# EAGLE design shield (EAGLE 9.0.1)
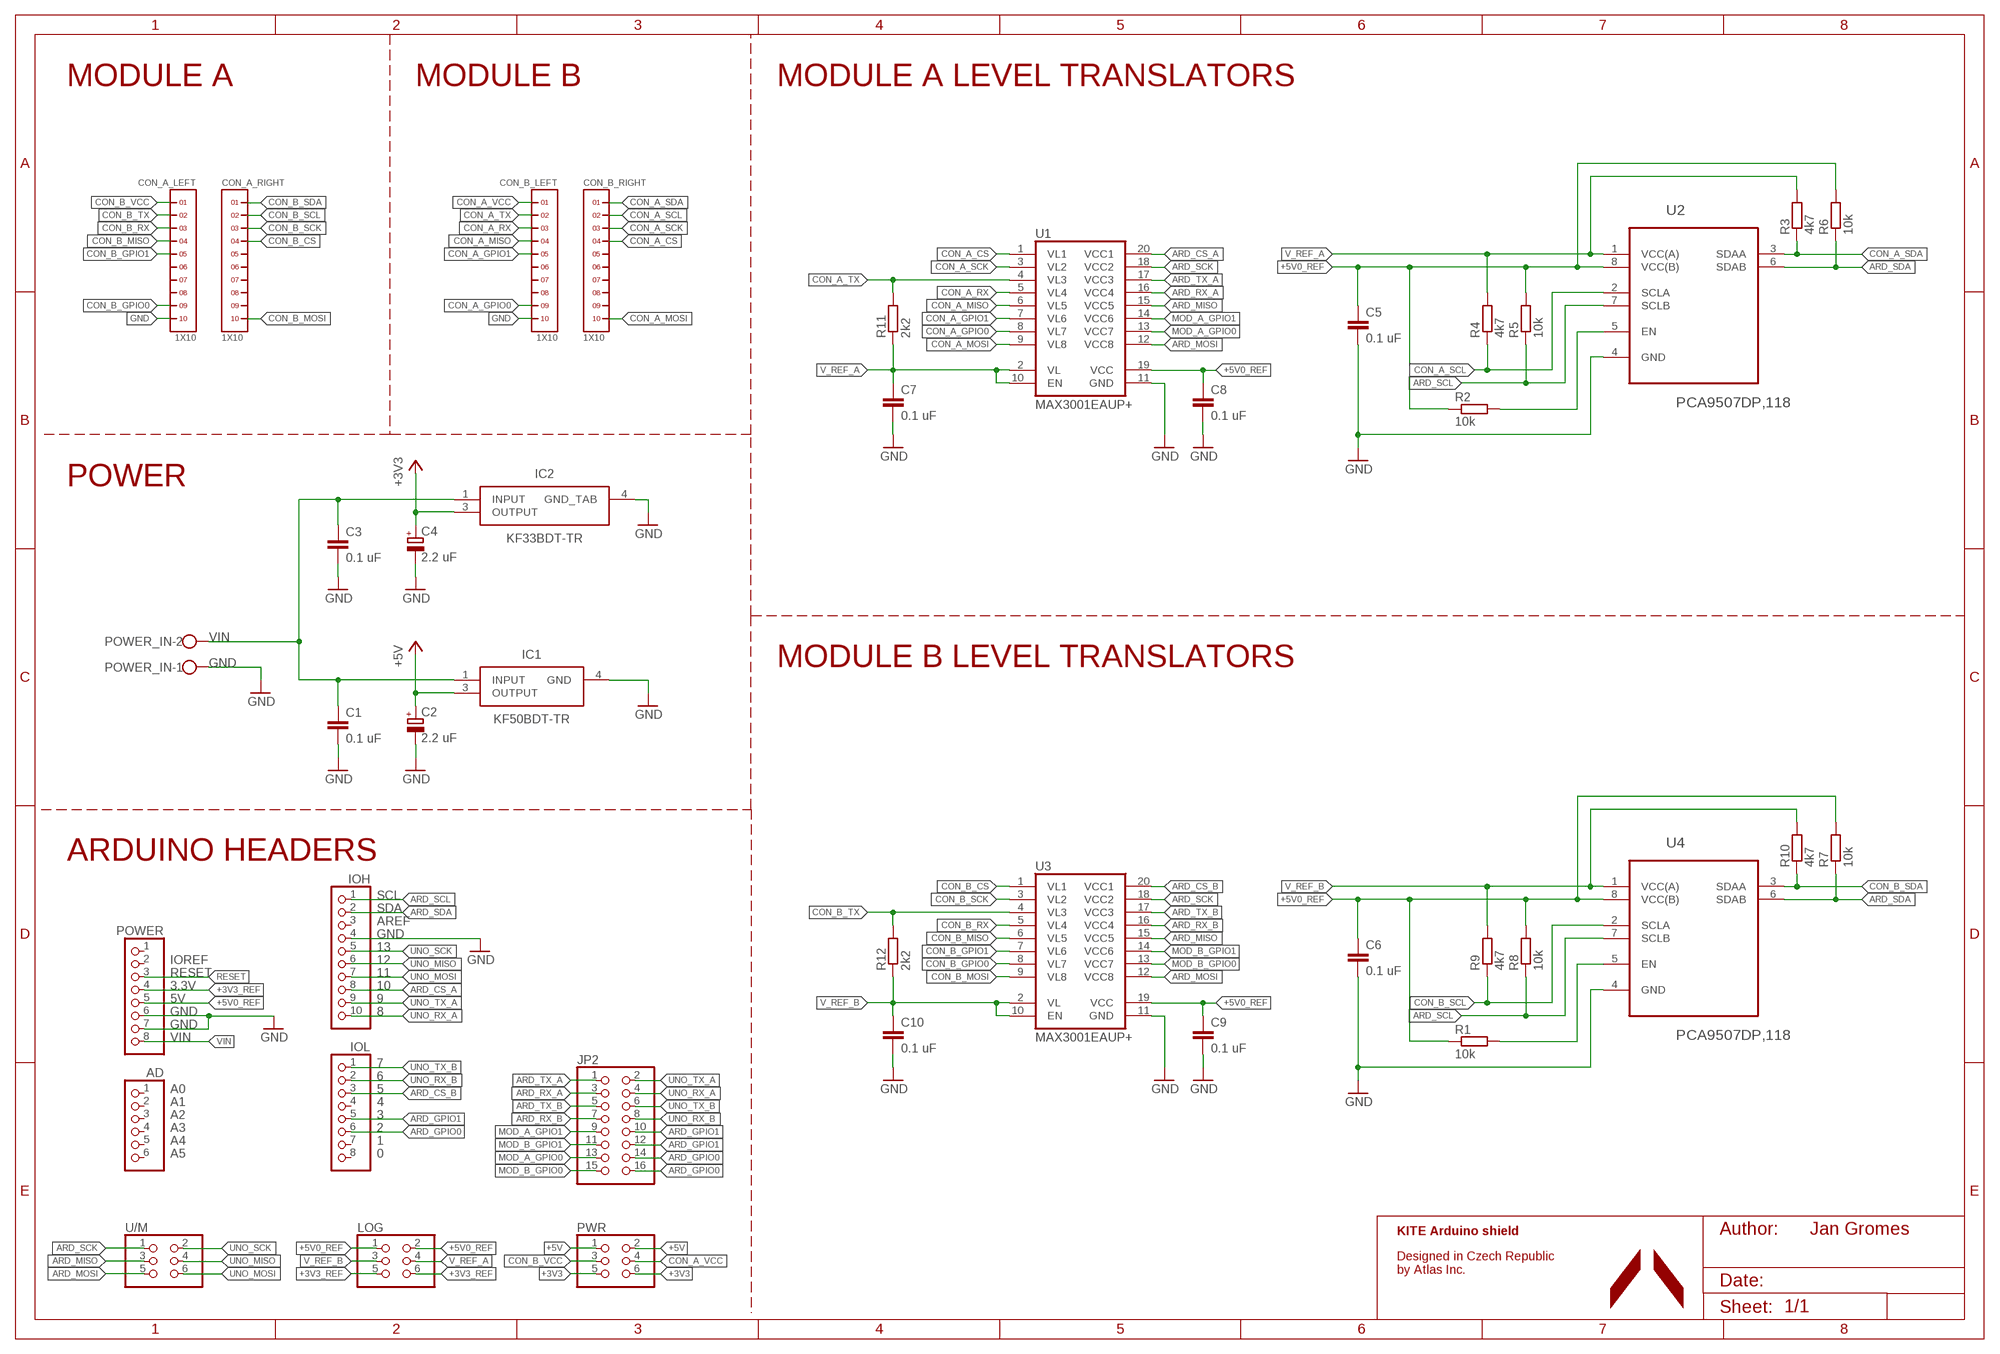
[diagram p0: schematic, sheet 1]

## Parts
AD  PINHD-1X6  [1X06]
C1  0.1 uF  C-EUC0603  [C0603]
C2  2.2 uF  CPOL-EUSMCA  [SMC_A]
C3  0.1 uF  C-EUC0603  [C0603]
C4  2.2 uF  CPOL-EUSMCA  [SMC_A]
C5  0.1 uF  C-EUC0603  [C0603]
C6  0.1 uF  C-EUC0603  [C0603]
C7  0.1 uF  C-EUC0603  [C0603]
C8  0.1 uF  C-EUC0603  [C0603]
C9  0.1 uF  C-EUC0603  [C0603]
C10  0.1 uF  C-EUC0603  [C0603]
CON_A_LEFT  1X10  [1X10]
CON_A_RIGHT  1X10  [1X10]
CON_B_LEFT  1X10  [1X10]
CON_B_RIGHT  1X10  [1X10]
IC1  KF50BDT-TR  [TO228P972X240-3N]
IC2  KF33BDT-TR  [TO228P972X240-3N]
IOH  PINHD-1X10  [1X10]
IOL  PINHD-1X8  [1X08]
JP2  PINHD-2X8  [2X08]
LOG  PINHD-2X3  [2X03]
POWER  PINHD-1X8  [1X08]
POWER_IN  W237-102  [W237-102]
PWR  PINHD-2X3  [2X03]
R1  10k  R-EU_R0603  [R0603]
R2  10k  R-EU_R0603  [R0603]
R3  4k7  R-EU_R0603  [R0603]
R4  4k7  R-EU_R0603  [R0603]
R5  10k  R-EU_R0603  [R0603]
R6  10k  R-EU_R0603  [R0603]
R7  10k  R-EU_R0603  [R0603]
R8  10k  R-EU_R0603  [R0603]
R9  4k7  R-EU_R0603  [R0603]
R10  4k7  R-EU_R0603  [R0603]
R11  2k2  R-EU_R0603  [R0603]
R12  2k2  R-EU_R0603  [R0603]
U1  MAX3001EAUP+  MAX3001  [TSSOP20]
U2  PCA9507DP,118  [SOP65P490X110-8N]
U3  MAX3001EAUP+  MAX3001  [TSSOP20]
U4  PCA9507DP,118  [SOP65P490X110-8N]
U/M  PINHD-2X3  [2X03]

## Nets
+3V3: C4.+ IC2.3(OUTPUT) PWR.5 PWR.6
+3V3_REF: LOG.5 LOG.6 POWER.4
+5V: C2.+ IC1.3(OUTPUT) PWR.1 PWR.2
+5V0_REF: C5.1 C6.1 C8.1 C9.1 LOG.1 LOG.2 POWER.5 R1.1 R2.1 R5.2 R6.2 R7.2 R8.2 U1.19(VCC) U2.8(VCC(B)) U3.19(VCC) U4.8(VCC(B))
ARD_CS_A: IOH.8 U1.20(VCC1)
ARD_CS_B: IOL.3 U3.20(VCC1)
ARD_GPIO0: IOL.6 JP2.14 JP2.16
ARD_GPIO1: IOL.5 JP2.10 JP2.12
ARD_MISO: U1.15(VCC5) U3.15(VCC5) U/M.3
ARD_MOSI: U1.12(VCC8) U3.12(VCC8) U/M.5
ARD_RX_A: JP2.3 U1.16(VCC4)
ARD_RX_B: JP2.7 U3.16(VCC4)
ARD_SCK: U1.18(VCC2) U3.18(VCC2) U/M.1
ARD_SCL: IOH.1 R5.1 R8.1 U2.7(SCLB) U4.7(SCLB)
ARD_SDA: IOH.2 R6.1 R7.1 U2.6(SDAB) U4.6(SDAB)
ARD_TX_A: JP2.1 U1.17(VCC3)
ARD_TX_B: JP2.5 U3.17(VCC3)
CON_A_CS: CON_B_RIGHT.4 U1.1(VL1)
CON_A_GPIO0: CON_B_LEFT.9 U1.8(VL7)
CON_A_GPIO1: CON_B_LEFT.5 U1.7(VL6)
CON_A_MISO: CON_B_LEFT.4 U1.6(VL5)
CON_A_MOSI: CON_B_RIGHT.10 U1.9(VL8)
CON_A_RX: CON_B_LEFT.3 U1.5(VL4)
CON_A_SCK: CON_B_RIGHT.3 U1.3(VL2)
CON_A_SCL: CON_B_RIGHT.2 R4.1 U2.2(SCLA)
CON_A_SDA: CON_B_RIGHT.1 R3.1 U2.3(SDAA)
CON_A_TX: CON_B_LEFT.2 R11.2 U1.4(VL3)
CON_A_VCC: CON_B_LEFT.1 PWR.4
CON_B_CS: CON_A_RIGHT.4 U3.1(VL1)
CON_B_GPIO0: CON_A_LEFT.9 U3.8(VL7)
CON_B_GPIO1: CON_A_LEFT.5 U3.7(VL6)
CON_B_MISO: CON_A_LEFT.4 U3.6(VL5)
CON_B_MOSI: CON_A_RIGHT.10 U3.9(VL8)
CON_B_RX: CON_A_LEFT.3 U3.5(VL4)
CON_B_SCK: CON_A_RIGHT.3 U3.3(VL2)
CON_B_SCL: CON_A_RIGHT.2 R9.1 U4.2(SCLA)
CON_B_SDA: CON_A_RIGHT.1 R10.1 U4.3(SDAA)
CON_B_TX: CON_A_LEFT.2 R12.2 U3.4(VL3)
CON_B_VCC: CON_A_LEFT.1 PWR.3
GND: C1.2 C2.- C3.2 C4.- C5.2 C6.2 C7.2 C8.2 C9.2 C10.2 CON_A_LEFT.10 CON_B_LEFT.10 IC1.4(GND) IC2.4(GND_TAB) IOH.4 POWER.6 POWER.7 POWER_IN.1 U1.11(GND) U2.4(GND) U3.11(GND) U4.4(GND)
MOD_A_GPIO0: JP2.13 U1.13(VCC7)
MOD_A_GPIO1: JP2.9 U1.14(VCC6)
MOD_B_GPIO0: JP2.15 U3.13(VCC7)
MOD_B_GPIO1: JP2.11 U3.14(VCC6)
N$1: R2.2 U2.5(EN)
N$2: R1.2 U4.5(EN)
RESET: POWER.3
UNO_MISO: IOH.6 U/M.4
UNO_MOSI: IOH.7 U/M.6
UNO_RX_A: IOH.10 JP2.4
UNO_RX_B: IOL.2 JP2.8
UNO_SCK: IOH.5 U/M.2
UNO_TX_A: IOH.9 JP2.2
UNO_TX_B: IOL.1 JP2.6
V_REF_A: C7.1 LOG.4 R3.2 R4.2 R11.1 U1.2(VL) U1.10(EN) U2.1(VCC(A))
V_REF_B: C10.1 LOG.3 R9.2 R10.2 R12.1 U3.2(VL) U3.10(EN) U4.1(VCC(A))
VIN: C1.1 C3.1 IC1.1(INPUT) IC2.1(INPUT) POWER.8 POWER_IN.2
Unconnected: AD.1 AD.2 AD.3 AD.4 AD.5 AD.6 CON_A_LEFT.6 CON_A_LEFT.7 CON_A_LEFT.8 CON_A_RIGHT.5 CON_A_RIGHT.6 CON_A_RIGHT.7 CON_A_RIGHT.8 CON_A_RIGHT.9 CON_B_LEFT.6 CON_B_LEFT.7 CON_B_LEFT.8 CON_B_RIGHT.5 CON_B_RIGHT.6 CON_B_RIGHT.7 CON_B_RIGHT.8 CON_B_RIGHT.9 IOH.3 IOL.4 IOL.7 IOL.8 POWER.1 POWER.2

## Notes on the sheet
- MODULE A | MODULE B | MODULE A LEVEL TRANSLATORS
- POWER
- MODULE B LEVEL TRANSLATORS
- ARDUINO HEADERS
- SCL
- SDA
- AREF
- 13
- IOREF | 12
- RESET | 11
- 3.3V | 10
- 5V | 9
- GND | 8
- VIN
- 7
- 6
- A0 | 5
- A1 | 4
- A2 | 3
- A3 | 2
- A4 | 1
- A5 | 0
- KITE Arduino shield | Jan Gromes
- Designed in Czech Republic
  by Atlas Inc.

## Library data of the parts
AD = pinhead:PINHD-1X6: PIN HEADER
C1 C3 C5-C10 = rcl:C-EU: CAPACITOR, European symbol
C2 C4 = rcl:CPOL-EU: POLARIZED CAPACITOR, European symbol; SPICEPREFIX: C
CON_A_LEFT CON_A_RIGHT CON_B_LEFT CON_B_RIGHT = headers(2mm):1X10
IC1 = KF50BDT-TR:KF50BDT-TR: KF50BDT-TR, Low Dropout Voltage Regulator, 0.5A, 5 V 2%, -0.5 20 Vin, 3-Pin DPAK <https://componentsearchengine.com/Images/3/KF50BDT-TR.jpg> Source: Datasheet <http://www.st.com/web/en/resource/technical/document/datasheet/CD00000970.pdf>; ALLIED_NUMBER: 70389972; DESCRIPTION: KF50BDT-TR, Low Dropout Voltage Regulator, 0.5A, 5 V 2%, -0.5 20 Vin, 3-Pin DPAK; HEIGHT: 2.4mm; MANUFACTURER_NAME: STMicroelectronics; MANUFACTURER_PART_NUMBER: KF50BDT-TR; RS_PART_NUMBER: 7140619; SUPPLIER_NAME: RS
IC2 = KF33BDT-TR:KF33BDT-TR: LDO Regulator, 3.3V, 0.5A, DPAK KF33BDT-TR, Low Dropout Voltage Regulator, 0.5A, 3.3 V 2%, 2.5 20 Vin, 3-Pin DPAK <https://componentsearchengine.com/Images/9/KF33BDT-TR.jpg> Source: Datasheet <http://www.st.com/web/en/resource/technical/document/datasheet/CD00000970.pdf>; ALLIED_NUMBER: 70389971; DESCRIPTION: LDO Regulator, 3.3V, 0.5A, DPAK KF33BDT-TR, Low Dropout Voltage Regulator, 0.5A, 3.3 V 2%, 2.5 20 Vin, 3-Pin DPAK; HEIGHT: 2.4mm; MANUFACTURER_NAME: STMicroelectronics; MANUFACTURER_PART_NUMBER: KF33BDT-TR; RS_PART_NUMBER: 7140616; SUPPLIER_NAME: RS
IOH = pinhead:PINHD-1X10: PIN HEADER
IOL POWER = pinhead:PINHD-1X8: PIN HEADER
JP2 = pinhead:PINHD-2X8: PIN HEADER
LOG PWR U/M = pinhead:PINHD-2X3: PIN HEADER
POWER_IN = con-wago-500:W237-102: WAGO SCREW CLAMP; MPN: 237-102; OC_FARNELL: unknown; OC_NEWARK: 70K9898
R1-R12 = rcl:R-EU_: RESISTOR, European symbol
U1 U3 = maxim-11:MAX30*: +1.2V to +5.5V, ±15kV ESD-Protected, 0.1?A, 35Mbps, 8-Channel Level Translators
U2 U4 = NXP_By_element14_Batch_1:PCA9507DP,118: 2-wire serial bus extender for HDMI DDC I2C-bus and SMBus; MPN: PCA9507DP,118; OC_FARNELL: -; OC_NEWARK: 70R6456; PACKAGE: TSSOP-8; SUPPLIER: NXP Semiconductors

## Board
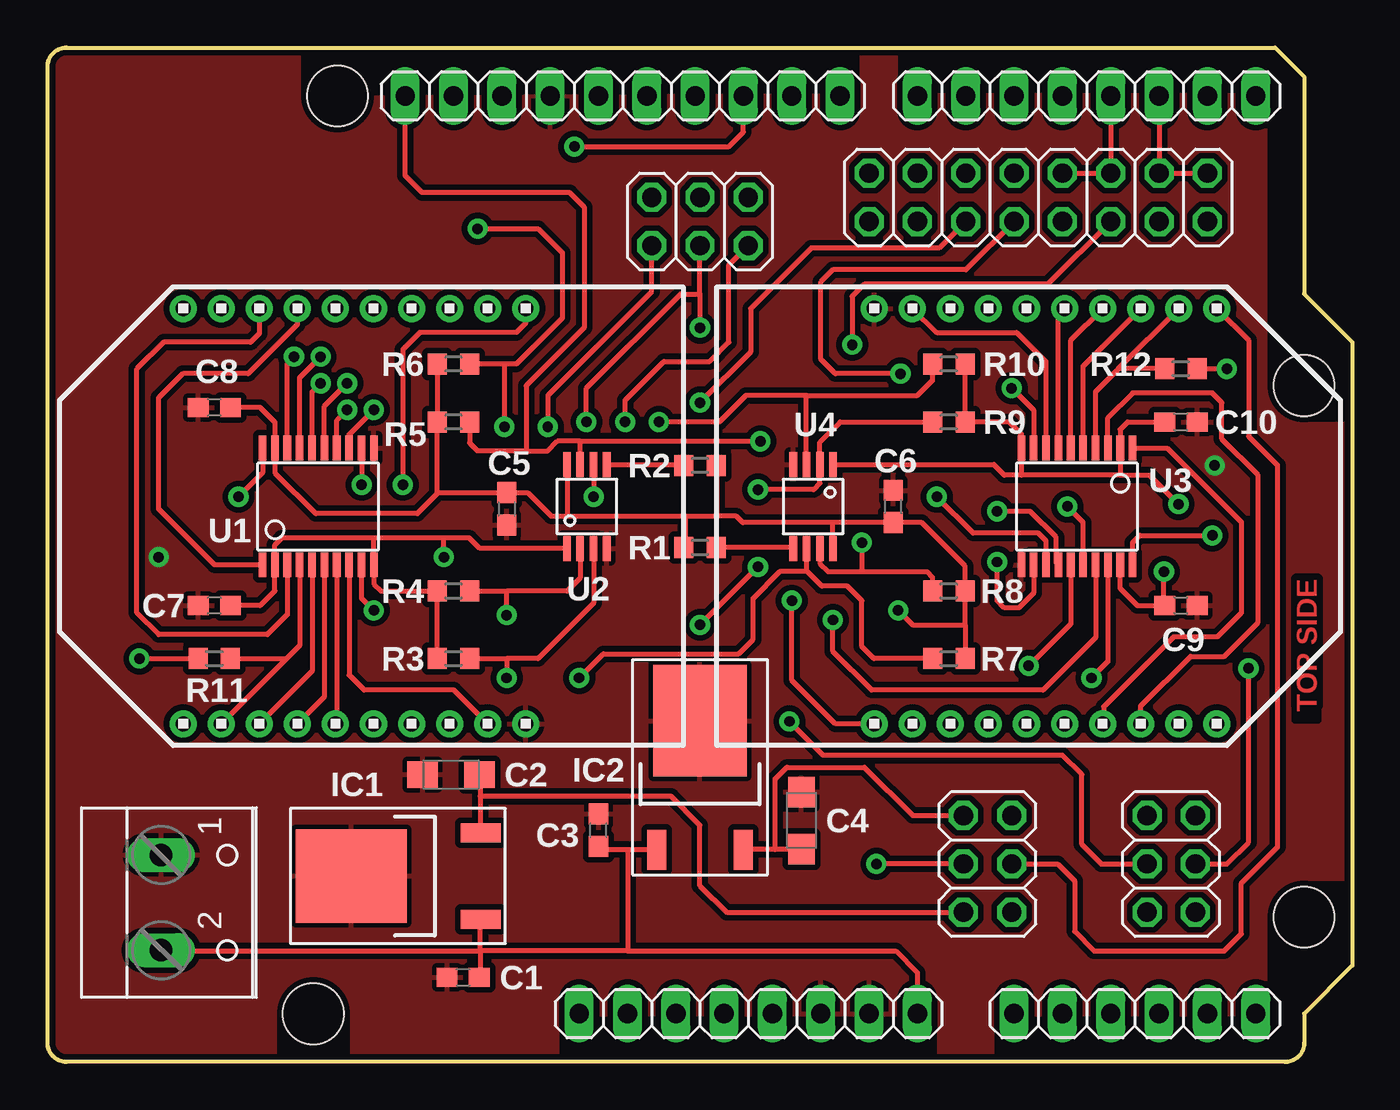
[diagram p1: board, top side]
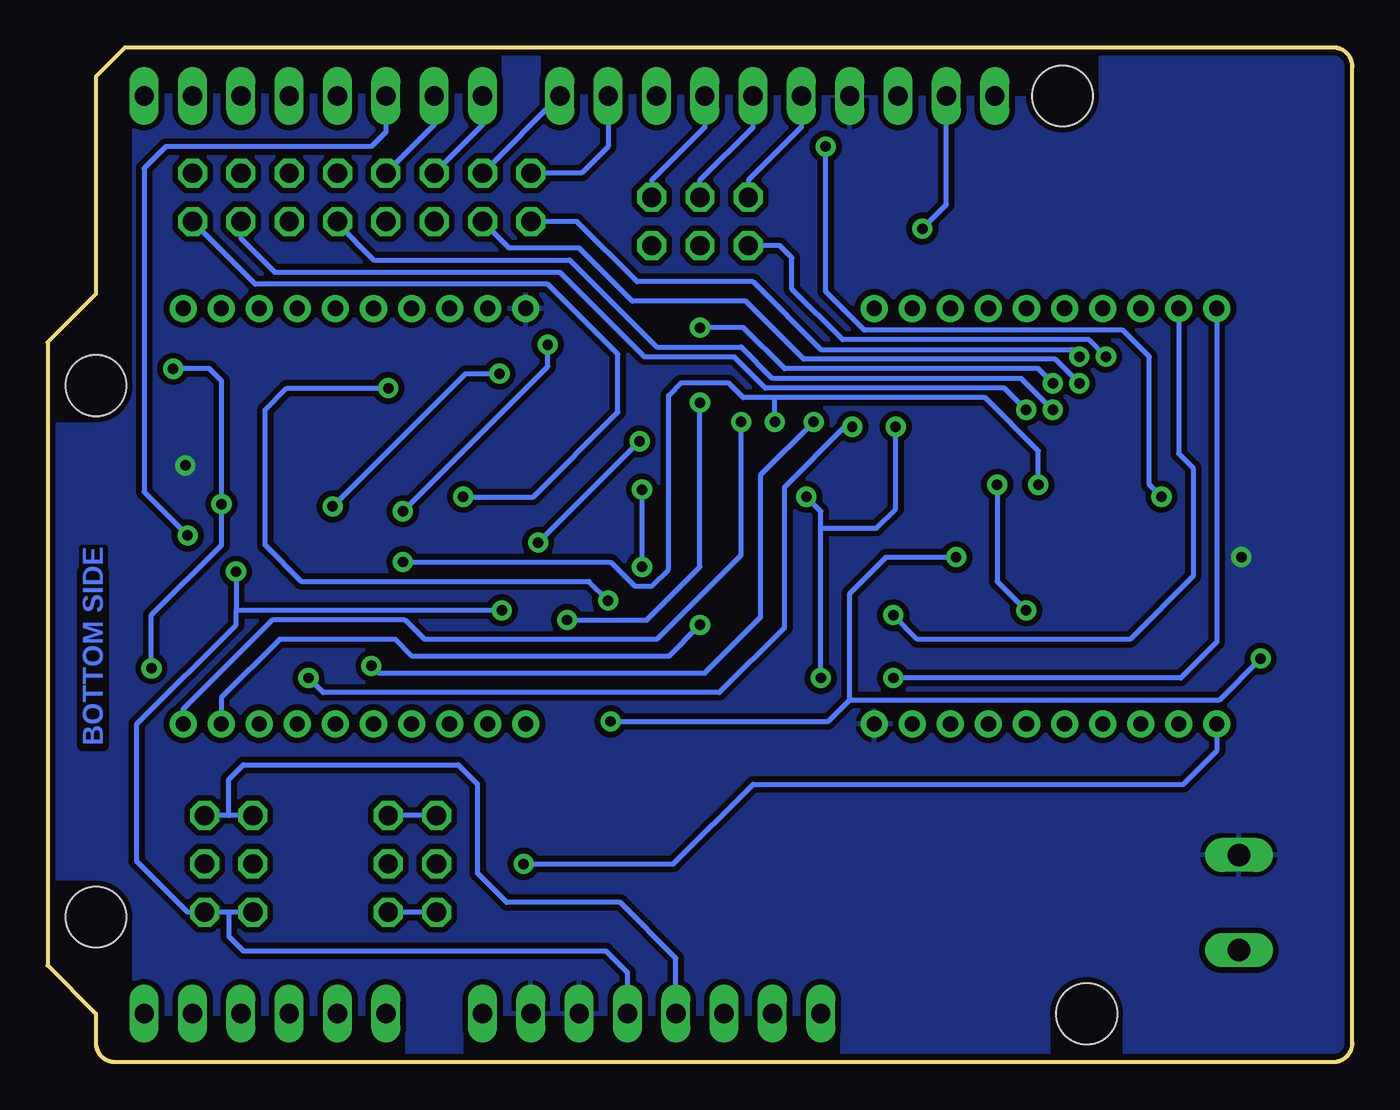
[diagram p2: board, bottom side, seen from below]

Size 68.58 x 53.34 mm. Coordinates in mm from the lower left corner, seen from the top.
Outline: 64.52,53.34 66.04,51.82 66.04,40.39 68.58,37.85 68.58,5.08 66.04,2.54 66.04,1 arc-90 65.04,0 1,0 arc-90 0,1 0,52.34 arc-90 1,53.34 64.52,53.34
Copper layers (1*16): Top 0.035mm / dielectric 1.5mm / Bottom 0.035mm
Design rules "SparkFun-2-layer-STANDARD": minimum track width 10mil, minimum drill 20mil, track to track 10mil, track to pad 8mil, pad to pad 8mil, via to via 10mil, smd to smd 8mil, copper to edge 8mil, drill to drill 8mil, minimum pad ring 10mil, minimum via ring 10mil, stop-mask expansion 4mil, vias tented up to drill 25mil, thermal gap 10mil
Holes 3.2 mm at 13.97,2.54 66.04,7.62 66.04,35.56 15.24,50.8

### Footprints (pad centres in the part's own frame; a part is rotated, then mirrored left to right if it is on the bottom)
1X06 = drill 1.016 long: 1 -6.35,0; 2 -3.81,0; 3 -1.27,0; 4 1.27,0; 5 3.81,0; 6 6.35,0
C0603 = smd 1.1 x 1: 1 -0.85,0; 2 0.85,0
SMC_A = smd 1.6 x 1.4: + -1.5,0; - 1.5,0
1X10 = drill 0.8 pad 1.422: 1 -9,0; 2 -7,0; 3 -5,0; 4 -3,0; 5 -1,0; 6 1,0; 7 3,0; 8 5,0; 9 7,0; 10 9,0
TO228P972X240-3N = smd 2.1 x 1: 1 -4.35,2.28; 3 -4.35,-2.28 | smd 5.85 x 4.9: 4 2.45,0
1X10' = drill 1.016 long: 1 -11.43,0; 2 -8.89,0; 3 -6.35,0; 4 -3.81,0; 5 -1.27,0; 6 1.27,0; 7 3.81,0; 8 6.35,0; 9 8.89,0; 10 11.43,0
1X08 = drill 1.016 long: 1 -8.89,0; 2 -6.35,0; 3 -3.81,0; 4 -1.27,0; 5 1.27,0; 6 3.81,0; 7 6.35,0; 8 8.89,0
2X08 = drill 1.016 octagon: 1 -8.89,-1.27; 2 -8.89,1.27; 3 -6.35,-1.27; 4 -6.35,1.27; 5 -3.81,-1.27; 6 -3.81,1.27; 7 -1.27,-1.27; 8 -1.27,1.27; 9 1.27,-1.27; 10 1.27,1.27; 11 3.81,-1.27; 12 3.81,1.27; 13 6.35,-1.27; 14 6.35,1.27; 15 8.89,-1.27; 16 8.89,1.27
2X03 = drill 1.016 octagon: 1 -2.54,-1.27; 2 -2.54,1.27; 3 0,-1.27; 4 0,1.27; 5 2.54,-1.27; 6 2.54,1.27
W237-102 = drill 1.194 long: 1 -2.5,-1.27; 2 2.5,-1.27
R0603 = smd 1 x 1.1: 1 -0.85,0; 2 0.85,0
TSSOP20 = smd 0.4 x 1.3: 1 -2.925,-3.068; 2 -2.275,-3.068; 3 -1.625,-3.068; 4 -0.975,-3.068; 5 -0.325,-3.068; 6 0.325,-3.068; 7 0.975,-3.068; 8 1.625,-3.068; 9 2.275,-3.068; 10 2.925,-3.068; 11 2.925,3.068; 12 2.275,3.068; 13 1.625,3.068; 14 0.975,3.068; 15 0.325,3.068; 16 -0.325,3.068; 17 -0.975,3.068; 18 -1.625,3.068; 19 -2.275,3.068; 20 -2.925,3.068
SOP65P490X110-8N = smd 1.3 x 0.4: 1 -2.207,1.015; 2 -2.207,0.33; 3 -2.207,-0.38; 4 -2.207,-1.065; 5 2.207,-1.065; 6 2.207,-0.38; 7 2.207,0.33; 8 2.207,1.015

### Placement (x,y rotation side)
AD  57.15,2.54 0 top
C1  21.84,4.45 180 top
C2  21.21,15.11 180 top
C3  28.96,12.19 90 top
C4  39.62,12.7 90 top
C5  24.13,29.08 270 top
C6  44.45,29.21 90 top
C7  8.76,24 180 top
C8  8.76,34.42 180 top
C9  59.56,24 0 top
C10  59.56,33.66 0 top
CON_A_LEFT  52.45,39.62 180 top
CON_A_RIGHT  52.45,17.78 180 top
CON_B_LEFT  16.13,17.78 0 top
CON_B_RIGHT  16.13,39.62 0 top
IC1  18.41,9.78 180 top
IC2  34.29,15.49 90 top
IOH  [1X10']  30.23,50.8 0 top
IOL  54.61,50.8 0 top
JP2  52.07,45.47 0 top
LOG  59.05,10.41 90 top
POWER  36.83,2.54 0 top
POWER_IN  7.24,8.38 270 top
PWR  49.4,10.41 90 top
R1  34.29,27.05 0 top
R2  34.29,31.37 180 top
R3  21.34,21.21 180 top
R4  21.34,24.77 180 top
R5  21.34,33.66 180 top
R6  21.34,36.7 180 top
R7  47.37,21.21 0 top
R8  47.37,24.77 0 top
R9  47.37,33.66 0 top
R10  47.37,36.7 0 top
R11  8.76,21.21 0 top
R12  59.56,36.45 180 top
U1  14.22,29.21 0 top
U2  28.32,29.21 90 top
U3  54.1,29.21 180 top
U4  40.26,29.21 270 top
U/M  34.29,44.2 0 top

### Tracks (layer width: path | path; a pad name or v marks a point on that pad's centre or on a via)
+3V3
  Top 0.254: 38.23,11.18 38.23,14.86 38.86,15.49 42.93,15.49 45.47,12.95 PWR.6 | 38.23,11.18 36.57,11.18 IC2.3 | C4.+ 39.6,11.18 38.23,11.18
  Bottom 0.254: PWR.6 PWR.5
+3V3_REF
  Bottom 0.254: POWER.4 35.56,5.46 38.48,8.38 44.45,8.38 45.97,9.91 45.97,14.61 46.99,15.62 58.29,15.62 59.05,14.86 59.05,12.95 | LOG.6 59.05,12.95 | 59.05,12.95 LOG.5
+5V
  Top 0.254: PWR.2 35.69,7.87 34.29,9.27 34.29,12.45 32.77,13.97 22.73,13.97 | 22.73,13.97 22.73,12.06 IC1.3 | C2.+ 22.73,15.09 22.73,13.97
  Bottom 0.254: PWR.2 PWR.1
+5V0_REF  (via drill 0.55)
  Top 0.254: C8.1 11.18,34.42 11.95,33.64 U1.19 11.95,30.98 14.1,28.83 19.43,28.83 20.49,29.88 20.49,29.93 | U3.19 56.38,24.9 57.28,24 C9.1 58.67,24.04 v58.67,25.78 | R6.2 R5.2 20.49,29.93 | 48.22,22.99 R7.2 | 48.22,22.99 R8.2 48.22,26.07 45.94,28.36 C6.1 41.27,28.36 | v44.7,23.75 45.47,22.99 48.22,22.99 | 33.53,28.7 35.18,28.7 | 27.31,28.7 26.46,28.7 25.23,29.93 C5.1 20.49,29.93 | 27.31,28.7 33.53,28.7 | R2.1 35.18,31.37 35.18,28.7 | R1.1 33.53,27.05 33.53,28.7 | U4.8 | U2.8 27.31,28.7 | 35.18,28.7 36.2,28.7 36.54,28.36 41.27,28.36 | U4.8 41.27,28.36
  Bottom 0.254: POWER.5 38.1,4.7 39.24,5.84 58.29,5.84 59.05,6.6 59.05,7.87 | v44.7,23.75 58.67,23.75 | v58.67,25.78 58.67,23.75 | 58.67,23.75 58.67,22.99 63.88,17.78 63.88,10.54 61.21,7.87 LOG.1 59.05,7.87 | LOG.2 59.05,7.87
ARD_CS_A  (via drill 0.55)
  Top 0.254: U1.20 11.3,30.98 v10.03,29.72 | v27.69,48.13 35.81,48.13 36.58,48.9 IOH.8
  Bottom 0.254: v10.03,29.72 10.67,30.35 10.67,37.08 12.06,38.48 25.65,38.48 27.69,40.51 v27.69,48.13
ARD_CS_B  (via drill 0.55)
  Top 0.254: U3.20 57.03,27.31 57.4,27.69 v61.21,27.69
  Bottom 0.254: v61.21,27.69 63.5,29.97 63.5,46.99 62.36,48.13 51.56,48.13 50.8,48.9 IOL.3
ARD_GPIO0
  Top 0.254: IOL.6 JP2.14 JP2.16
ARD_GPIO1
  Top 0.254: IOL.5 JP2.12 JP2.10
ARD_MISO  (via drill 0.55)
  Top 0.254: U1.15 14.55,34.49 v15.75,35.69 | U3.15 53.78,23.04 v51.56,20.83 | 34.29,40.39 U/M.3 | 34.29,40.39 v34.29,38.61 | 34.29,40.39 33.27,40.39 28.32,35.43 v28.32,33.66
  Bottom 0.254: v15.75,35.69 16.51,36.45 29.84,36.45 32,38.61 v34.29,38.61 | v28.32,33.66 31.11,30.86 31.11,23.37 34.04,20.45 51.18,20.45 v51.56,20.83
ARD_MOSI  (via drill 0.55)
  Top 0.254: v30.35,33.66 30.35,34.8 32.38,36.83 34.8,36.83 35.81,37.85 35.81,41.91 U/M.5 | U1.12 16.51,32.27 v16.51,30.35 | U3.12 51.83,24.65 51.05,23.88 50.29,23.88 49.91,24.26 v49.91,26.29
  Bottom 0.254: v16.51,30.35 16.51,32.13 19.3,34.92 30.35,34.92 | v30.35,33.66 30.35,34.92 | 30.35,34.92 32,34.92 32.77,35.69 35.31,35.69 35.94,35.05 35.94,25.91 36.83,25.02 37.72,25.02 38.99,26.29 v49.91,26.29
ARD_RX_A  (via drill 0.55)
  Top 0.254: U1.16 13.9,35.23 v14.35,35.69
  Bottom 0.254: v14.35,35.69 15.62,36.96 28.83,36.96 31.88,40.01 37.85,40.01 40.64,42.8 44.32,42.8 JP2.3
ARD_RX_B  (via drill 0.55)
  Top 0.254: JP2.7 48.26,41.66 41.27,41.66 40.64,41.02 40.64,36.96 41.4,36.2 v44.83,36.2 | U3.16 54.43,28.38 v53.59,29.21
  Bottom 0.254: v53.59,29.21 46.61,36.2 v44.83,36.2
ARD_SCK  (via drill 0.55)
  Top 0.254: U1.18 12.6,36.73 v12.95,37.08 | U/M.1 31.75,40.51 26.29,35.05 v26.29,33.4 | U3.18 55.73,21.06 v54.86,20.19
  Bottom 0.254: v12.95,37.08 13.84,37.97 26.8,37.97 29.46,40.64 29.46,42.29 30.1,42.93 U/M.1 | v54.86,20.19 54.1,19.43 33.27,19.43 29.84,22.86 29.84,30.23 26.67,33.4 v26.29,33.4
ARD_SCL  (via drill 0.55)
  Top 0.254: 27.99,32.64 26.8,32.64 26.29,32.13 25.15,32.13 | 27.99,32.64 v37.47,32.64 | R5.1 22.19,32.55 22.61,32.13 25.15,32.13 | 25.15,32.13 25.15,35.56 28.19,38.61 28.19,44.96 27.43,45.72 19.68,45.72 18.8,46.61 IOH.1 | R8.1 46.52,25.49 46.23,25.78 42.8,25.78 | v42.8,27.3 42.8,25.78 | U2.7 27.99,32.64 | U4.7 40.59,26.21 41.02,25.78 42.8,25.78
  Bottom 0.254: v42.8,27.3 v37.47,32.64
ARD_SDA  (via drill 0.55)
  Top 0.254: 24,36.7 R6.1 | 24,36.7 v24,33.4 | v22.61,43.81 25.78,43.81 27.05,42.55 27.05,39.12 24.64,36.7 24,36.7 | 39.93,25.78 38.48,25.78 37.08,24.38 37.08,22.23 36.32,21.46 29.21,21.46 v27.94,20.19 | R7.1 43.43,21.21 42.8,21.84 42.8,24.26 42.04,25.02 40.69,25.02 39.93,25.78 | U2.6 v28.7,29.72 | U4.6 39.88,25.83 39.93,25.78
  Bottom 0.254: v24,33.4 24,29.08 25.02,28.07 27.94,28.07 | v27.94,20.19 27.94,28.07 | 27.94,28.07 27.94,28.96 v28.7,29.72 | v22.61,43.81 21.34,45.09 IOH.2
ARD_TX_A  (via drill 0.55)
  Top 0.254: U1.17 13.25,35.98 v14.35,37.08
  Bottom 0.254: v14.35,37.08 14.73,37.47 27.94,37.47 31.5,41.02 37.59,41.02 40.77,44.2 JP2.1
ARD_TX_B  (via drill 0.55)
  Top 0.254: U3.17 55.08,22.31 52.32,19.56 43.31,19.56 41.27,21.59 v41.27,23.24 | v34.29,34.67 36.96,37.34 36.96,39.62 40.13,42.8 46.86,42.8 JP2.5
  Bottom 0.254: v34.29,34.67 34.29,26.04 37.08,23.24 v41.27,23.24
CON_A_CS
  Top 0.254: CON_B_RIGHT.4 13.13,38.78 10.54,36.2 7.11,36.2 5.84,34.92 5.84,29.08 8.78,26.14 U1.1
CON_A_GPIO0
  Top 0.254: U1.8 15.85,20.35 16.64,19.56 21.35,19.56 CON_B_LEFT.9
CON_A_GPIO1
  Top 0.254: CON_B_LEFT.5 15.11,17.8 15.11,17.78 15.2,17.87 U1.7
CON_A_MISO
  Top 0.254: CON_B_LEFT.4 14.55,19.2 U1.6
CON_A_MOSI  (via drill 0.55)
  Top 0.254: U1.9 16.5,24.39 v17.14,23.75 | CON_B_RIGHT.10 25.13,38.84 24.64,38.35 19.56,38.35 18.67,37.47 v18.67,30.35
  Bottom 0.254: v18.67,30.35 18.67,25.27 v17.14,23.75
CON_A_RX
  Top 0.254: CON_B_LEFT.3 13.9,20.55 U1.5
CON_A_SCK
  Top 0.254: CON_B_RIGHT.3 11.13,38.31 10.67,37.85 6.1,37.85 4.7,36.45 4.7,23.62 5.84,22.48 11.56,22.48 12.6,23.52 U1.3
CON_A_SCL  (via drill 0.55)
  Top 0.254: R4.1 24.13,24.77 | v24.13,23.5 24.13,24.77 | 24.13,24.77 27.3,24.77 27.99,25.45 U2.2
  Bottom 0.254: v24.13,23.5 22.86,22.23 11.68,22.23 8.37,25.54 8.37,31.23 9.13,31.99 CON_B_RIGHT.2
CON_A_SDA  (via drill 0.55)
  Top 0.254: R3.1 24.13,21.21 | 24.13,21.21 25.78,21.21 28.7,24.13 U2.3 | 24.13,21.21 v24.13,20.19
  Bottom 0.254: CON_B_RIGHT.1 7.13,22.08 9.02,20.19 v24.13,20.19
CON_A_TX
  Top 0.254: 12.56,21.21 CON_B_LEFT.2 | U1.4 13.25,21.9 12.57,21.22 12.56,21.21 | R11.2 12.56,21.21
CON_A_VCC  (via drill 0.55)
  Top 0.254: PWR.4 v43.56,10.41
  Bottom 0.254: v43.56,10.41 35.69,10.41 31.5,14.61 8.89,14.61 7.11,16.38 7.11,17.76 CON_B_LEFT.1
CON_B_CS
  Top 0.254: CON_A_RIGHT.4 55.5,17.83 55.5,18.67 59.18,22.35 61.47,22.35 62.74,23.62 62.74,28.38 58.84,32.28 U3.1
CON_B_GPIO0
  Top 0.254: U3.8 52.48,36.8 50.93,38.35 46.72,38.35 CON_A_LEFT.9
CON_B_GPIO1
  Top 0.254: CON_A_LEFT.5 53.13,39.3 U3.7
CON_B_MISO
  Top 0.254: CON_A_LEFT.4 53.78,37.95 U3.6
CON_B_MOSI  (via drill 0.55)
  Top 0.254: CON_A_RIGHT.10 41.4,17.78 39.12,20.07 v39.12,24.26 | v50.67,35.43 51.83,34.28 U3.9
  Bottom 0.254: v50.67,35.43 56.01,35.43 57.15,34.29 57.15,27.18 55.24,25.27 40.13,25.27 v39.12,24.26
CON_B_RX
  Top 0.254: CON_A_LEFT.3 54.43,36.6 U3.5
CON_B_SCK
  Top 0.254: U3.3 55.73,33.88 57.02,35.18 61.21,35.18 61.72,34.67 61.72,32.77 63.63,30.86 63.63,23.11 61.85,21.34 60.07,21.34 57.45,18.72 CON_A_RIGHT.3
CON_B_SCL  (via drill 0.55)
  Top 0.254: R9.1 41.66,33.66 40.59,32.59 U4.2 40.59,30.43 40.26,30.1 v37.34,30.1 | v34.29,22.99 v37.34,26.04
  Bottom 0.254: CON_A_RIGHT.2 59.45,19.16 56.39,22.23 50.29,22.23 49.4,21.34 35.94,21.34 v34.29,22.99 | v37.34,26.04 v37.34,30.1
CON_B_SDA  (via drill 0.55)
  Top 0.254: v32.13,33.66 35.31,33.66 36.7,35.05 39.88,35.05 | R10.1 46.52,35.85 45.72,35.05 39.88,35.05 | U4.3 39.88,35.05
  Bottom 0.254: CON_A_RIGHT.1 61.45,18.56 56.77,23.24 49.78,23.24 48.77,22.23 36.58,22.23 32.13,26.67 v32.13,33.66
CON_B_TX
  Top 0.254: 56.28,36.45 CON_A_LEFT.2 | U3.4 55.08,35.25 56.27,36.44 56.28,36.45 | R12.2 56.28,36.45
CON_B_VCC
  Top 0.254: PWR.3 53.09,10.41 53.98,9.53 53.98,6.86 54.99,5.84 61.85,5.84 62.74,6.73 62.74,9.4 64.64,11.3 64.64,31.37 63.12,32.89 63.12,37.96 CON_A_LEFT.1
GND  (via drill 0.55)
  other vias: 5.84,26.54 61.34,31.37
  pour Top (isolate 0.305): -0.25,-0.25 11.94,-0.25 11.94,2.67 16,2.67 16,-0.25 26.8,-0.25 26.8,2.54 46.86,2.54 46.86,-0.25 49.66,-0.25 49.66,2.54 64.01,2.54 64.01,7.75 65.91,7.75 65.91,9.65 68.83,9.65 68.83,33.53 65.91,33.53 65.91,35.43 64.01,35.43 64.01,50.8 44.58,50.8 44.58,53.59 42.8,53.59 42.8,50.8 13.21,50.67 13.21,53.59 -0.25,53.59
  pour Bottom (isolate 0.305): -0.51,-0.51 11.94,-0.51 11.94,2.67 16,2.67 16,-0.51 26.8,-0.51 26.8,2.54 46.86,2.54 46.86,-0.51 49.66,-0.51 49.66,2.54 64.01,2.54 64.01,7.75 65.91,7.75 65.91,9.65 69.09,9.65 69.09,33.53 65.91,33.53 65.91,35.43 64.01,35.43 64.01,50.8 44.58,50.8 44.58,53.85 42.8,53.85 42.8,50.8 13.21,50.67 13.21,53.85 -0.51,53.85
MOD_A_GPIO0  (via drill 0.55)
  Top 0.254: U1.13 15.85,32.99 v17.14,34.29
  Bottom 0.254: JP2.13 58.42,43.31 56.64,41.53 41.66,41.53 37.21,37.08 32.51,37.08 30.86,35.43 18.29,35.43 v17.14,34.29
MOD_A_GPIO1  (via drill 0.55)
  Top 0.254: U1.14 15.2,33.74 v15.75,34.29
  Bottom 0.254: JP2.9 53.34,44.07 51.44,42.16 41.15,42.16 36.58,37.59 32.13,37.59 30.48,35.94 17.4,35.94 v15.75,34.29
MOD_B_GPIO0  (via drill 0.55)
  Top 0.254: U3.13 52.48,27.41 52.07,27.81 48.64,27.81 v46.74,29.72
  Bottom 0.254: JP2.15 57.66,40.89 42.29,40.89 38.61,37.21 38.61,34.16 43.05,29.72 v46.74,29.72
MOD_B_GPIO1  (via drill 0.55)
  Top 0.254: JP2.11 52.58,40.89 42.93,40.89 42.29,40.26 v42.29,37.72 | U3.14 53.01,26.26 53.01,27.59 51.65,28.96 v49.91,28.96
  Bottom 0.254: v49.91,28.96 42.29,36.58 v42.29,37.72
N$1
  Top 0.254: U2.5 33.44,31.42 R2.2
N$2
  Top 0.254: U4.5 39.19,27.05 R1.2
N$8
  cutout Bottom: 66.8,27.05 66.8,16.64 65.53,16.64 65.53,27.05
N$9
  cutout Top: 66.8,25.53 66.8,17.91 65.53,17.91 65.53,25.53
UNO_MISO
  Bottom 0.254: U/M.4 34.29,46.35 31.5,49.15 IOH.6
UNO_MOSI
  Bottom 0.254: IOH.7 34.04,49.15 36.83,46.35 U/M.6
UNO_RX_A
  Bottom 0.254: IOH.10 JP2.4
UNO_RX_B
  Bottom 0.254: IOL.2 48.26,49.28 JP2.8
UNO_SCK
  Bottom 0.254: IOH.5 28.96,49.15 31.75,46.35 U/M.2
UNO_TX_A
  Bottom 0.254: IOH.9 39.12,48.13 40.51,46.74 JP2.2
UNO_TX_B
  Bottom 0.254: IOL.1 45.72,49.28 JP2.6
V_REF_A  (via drill 0.55)
  Top 0.254: C7.1 11.18,24 11.95,24.78 U1.2 11.95,27.19 12.32,27.56 17.14,27.56 | 20.83,27.56 17.14,27.56 | R3.2 R4.2 17.53,24.77 17.15,25.14 U1.10 17.15,27.55 17.14,27.56 | v38.99,17.91 40.77,16.13 53.34,16.13 54.36,15.11 54.36,11.43 55.37,10.41 LOG.4 | 20.83,27.56 22.16,27.56 22.72,27 U2.1 | v20.83,26.54 20.83,27.56 | v4.83,21.21 R11.1
  Bottom 0.254: v38.99,17.91 27.56,17.91 26.42,19.05 | 26.42,19.05 26.42,24.64 24.51,26.54 v20.83,26.54 | 26.42,19.05 6.99,19.05 v4.83,21.21
V_REF_B  (via drill 0.55)
  Top 0.254: C10.1 56.77,33.66 56.38,33.26 U3.2 56.38,30.86 | R10.2 R9.2 50.55,33.66 51.18,33.02 U3.10 51.18,30.86 | v59.44,29.34 57.91,30.86 56.38,30.86 | 56.38,30.86 51.18,30.86 | 51.18,30.86 50.29,30.86 49.74,31.42 U4.1 | LOG.3 61.98,10.41 63.12,11.56 v63.12,20.7 | R12.1 v61.98,36.45
  Bottom 0.254: v63.12,20.7 63.12,23.5 59.44,27.18 v59.44,29.34 59.44,35.81 60.07,36.45 v61.98,36.45
VIN
  Top 0.254: 22.73,5.84 6.01,5.84 POWER_IN.2 | 30.48,5.84 22.73,5.84 | 30.48,5.84 44.58,5.84 45.72,4.7 POWER.8 | 30.48,11.18 30.48,5.84 | 22.73,5.84 22.73,7.47 IC1.1 | 30.48,11.18 31.98,11.18 IC2.1 | C3.1 28.96,11.18 30.48,11.18 | 22.73,5.84 22.73,4.45 C1.1

### Text on the board
Top: TOP SIDE
Bottom: BOTTOM SIDE
_tDocu: SCL | SDA | AREF | GND | 13 | 12 | 11 | 10 | 9 | 8 | 7 | 6 | 5 | 4 | 3 | 2 | 1 | 0 | KITE Shield | U/M | Rev. B | MODULE A | MODULE B | A | B | A | B | GND | LOG | 3.3V | PWR | 5V | IOREF | RESET | 3.3V | 5V | GND | GND | VIN | A0 | A1 | A2 | A3 | A4 | A5 | VIN